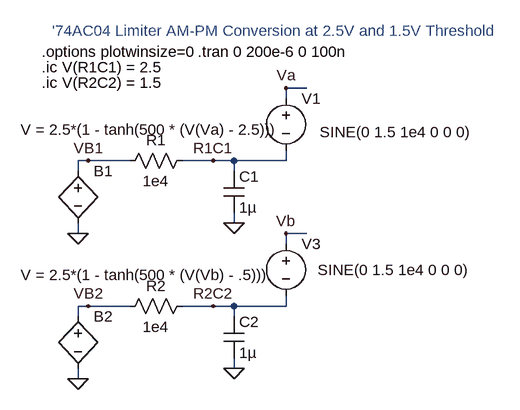
[diagram p0: schematic aclim00.asc]
aclim00.asc, the LTspice schematic file:
Version 4
SHEET 1 1260 864
WIRE 16 32 -16 32
WIRE -16 48 -16 32
WIRE -320 144 -336 144
WIRE -256 144 -320 144
WIRE -128 144 -176 144
WIRE -96 144 -128 144
WIRE -16 144 -16 128
WIRE -16 144 -96 144
WIRE -336 160 -336 144
WIRE -96 160 -96 144
WIRE -96 240 -96 224
WIRE -336 256 -336 240
WIRE 16 256 -16 256
WIRE -16 272 -16 256
WIRE -320 368 -336 368
WIRE -256 368 -320 368
WIRE -128 368 -176 368
WIRE -96 368 -128 368
WIRE -16 368 -16 352
WIRE -16 368 -96 368
WIRE -336 384 -336 368
WIRE -96 384 -96 368
WIRE -96 464 -96 448
WIRE -336 480 -336 464
FLAG -16 32 Va
FLAG -96 240 0
FLAG -336 256 0
FLAG -128 144 R1C1
FLAG -320 144 VB1
FLAG -16 256 Vb
FLAG -96 464 0
FLAG -336 480 0
FLAG -128 368 R2C2
FLAG -320 368 VB2
SYMBOL Voltage -16 32 R0
WINDOW 123 0 0 Left 0
WINDOW 39 0 0 Left 0
WINDOW 3 52 68 Left 0
SYMATTR Value SINE(0 1.5 1e4 0 0 0)
SYMATTR InstName V1
SYMBOL cap -112 160 R0
SYMATTR InstName C1
SYMATTR Value 1µ
SYMBOL bv -336 144 R0
WINDOW 3 -88 -48 Left 0
SYMATTR Value V = 2.5*(1 - tanh(500 * (V(Va) - 2.5)))
SYMATTR InstName B1
SYMBOL res -272 160 R270
WINDOW 0 32 56 VTop 0
WINDOW 3 0 56 VBottom 0
SYMATTR InstName R1
SYMATTR Value 1e4
SYMBOL Voltage -16 256 R0
WINDOW 123 0 0 Left 0
WINDOW 39 0 0 Left 0
WINDOW 3 49 56 Left 0
SYMATTR Value SINE(0 1.5 1e4 0 0 0)
SYMATTR InstName V3
SYMBOL cap -112 384 R0
SYMATTR InstName C2
SYMATTR Value 1µ
SYMBOL bv -336 368 R0
WINDOW 3 -88 -48 Left 0
SYMATTR Value V = 2.5*(1 - tanh(500 * (V(Vb) - .5)))
SYMATTR InstName B2
SYMBOL res -272 384 R270
WINDOW 0 32 56 VTop 0
WINDOW 3 0 56 VBottom 0
SYMATTR InstName R2
SYMATTR Value 1e4
TEXT -376 -56 Left 0 ;'74AC04 Limiter AM-PM Conversion at 2.5V and 1.5V Threshold
TEXT -152 -24 Left 0 !.tran 0 200e-6 0 100n
TEXT -392 -24 Left 0 !.options plotwinsize=0
TEXT -392 0 Left 0 !.ic V(R1C1) = 2.5
TEXT -392 24 Left 0 !.ic V(R2C2) = 1.5

The netlist it stands for:
* aclim00.asc
V1 Va R1C1 SINE(0 1.5 1e4 0 0 0)
C1 R1C1 0 1µ
B1 VB1 0 V = 2.5*(1 - tanh(500 * (V(Va) - 2.5)))
R1 VB1 R1C1 1e4
V3 Vb R2C2 SINE(0 1.5 1e4 0 0 0)
C2 R2C2 0 1µ
B2 VB2 0 V = 2.5*(1 - tanh(500 * (V(Vb) - .5)))
R2 VB2 R2C2 1e4
* '74AC04 Limiter AM-PM Conversion at 2.5V and 1.5V Threshold
.tran 0 200e-6 0 100n
.options plotwinsize=0
.ic V(R1C1) = 2.5
.ic V(R2C2) = 1.5
.backanno
.end